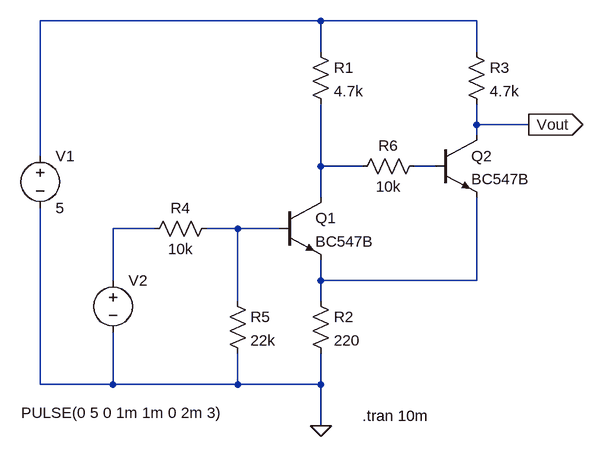
[diagram p0: schematic trans_trigger.asc]
trans_trigger.asc, the LTspice schematic file:
Version 4
SHEET 1 1872 1076
WIRE 128 -288 -304 -288
WIRE 368 -288 128 -288
WIRE 128 -240 128 -288
WIRE 368 -240 368 -288
WIRE 368 -128 368 -160
WIRE 448 -128 368 -128
WIRE 368 -112 368 -128
WIRE -304 -80 -304 -288
WIRE 128 -64 128 -160
WIRE 192 -64 128 -64
WIRE 304 -64 272 -64
WIRE 128 -16 128 -64
WIRE -128 32 -192 32
WIRE 0 32 -48 32
WIRE 64 32 0 32
WIRE -192 112 -192 32
WIRE 128 112 128 80
WIRE 368 112 368 -16
WIRE 368 112 128 112
WIRE 0 144 0 32
WIRE 128 144 128 112
WIRE -304 272 -304 0
WIRE -192 272 -192 192
WIRE -192 272 -304 272
WIRE 0 272 0 224
WIRE 0 272 -192 272
WIRE 128 272 128 224
WIRE 128 272 0 272
WIRE 128 336 128 272
FLAG 448 -128 Vout
IOPIN 448 -128 Out
FLAG 128 336 0
SYMBOL npn 64 -16 R0
SYMATTR InstName Q1
SYMATTR Value BC547B
SYMBOL res 112 -256 R0
SYMATTR InstName R1
SYMATTR Value 4.7k
SYMBOL voltage -304 -96 R0
WINDOW 123 0 0 Left 0
WINDOW 39 0 0 Left 0
SYMATTR InstName V1
SYMATTR Value 5
SYMBOL res 112 128 R0
SYMATTR InstName R2
SYMATTR Value 220
SYMBOL npn 304 -112 R0
SYMATTR InstName Q2
SYMATTR Value BC547B
SYMBOL res 352 -256 R0
SYMATTR InstName R3
SYMATTR Value 4.7k
SYMBOL voltage -192 96 R0
WINDOW 123 0 0 Left 0
WINDOW 39 0 0 Left 0
WINDOW 3 -141 220 Left 2
SYMATTR Value PULSE(0 5 0 1m 1m 0 2m 3)
SYMATTR InstName V2
SYMBOL res -32 16 R90
WINDOW 0 0 56 VBottom 2
WINDOW 3 32 56 VTop 2
SYMATTR InstName R4
SYMATTR Value 10k
SYMBOL res -16 128 R0
SYMATTR InstName R5
SYMATTR Value 22k
SYMBOL res 288 -80 R90
WINDOW 0 0 56 VBottom 2
WINDOW 3 32 56 VTop 2
SYMATTR InstName R6
SYMATTR Value 10k
TEXT 192 320 Left 2 !.tran 10m

The netlist it stands for:
* trans_trigger.asc
Q1 N002 N005 N006 0 BC547B
R1 N001 N002 4.7k
V1 N001 0 5
R2 N006 0 220
Q2 Vout N003 N006 0 BC547B
R3 N001 Vout 4.7k
V2 N004 0 PULSE(0 5 0 1m 1m 0 2m 3)
R4 N005 N004 10k
R5 N005 0 22k
R6 N003 N002 10k
.model NPN NPN
.model PNP PNP
.lib standard.bjt
.tran 10m
.backanno
.end